# Altium schematic sheet IndAlarmIf1s.SchDoc
size A4
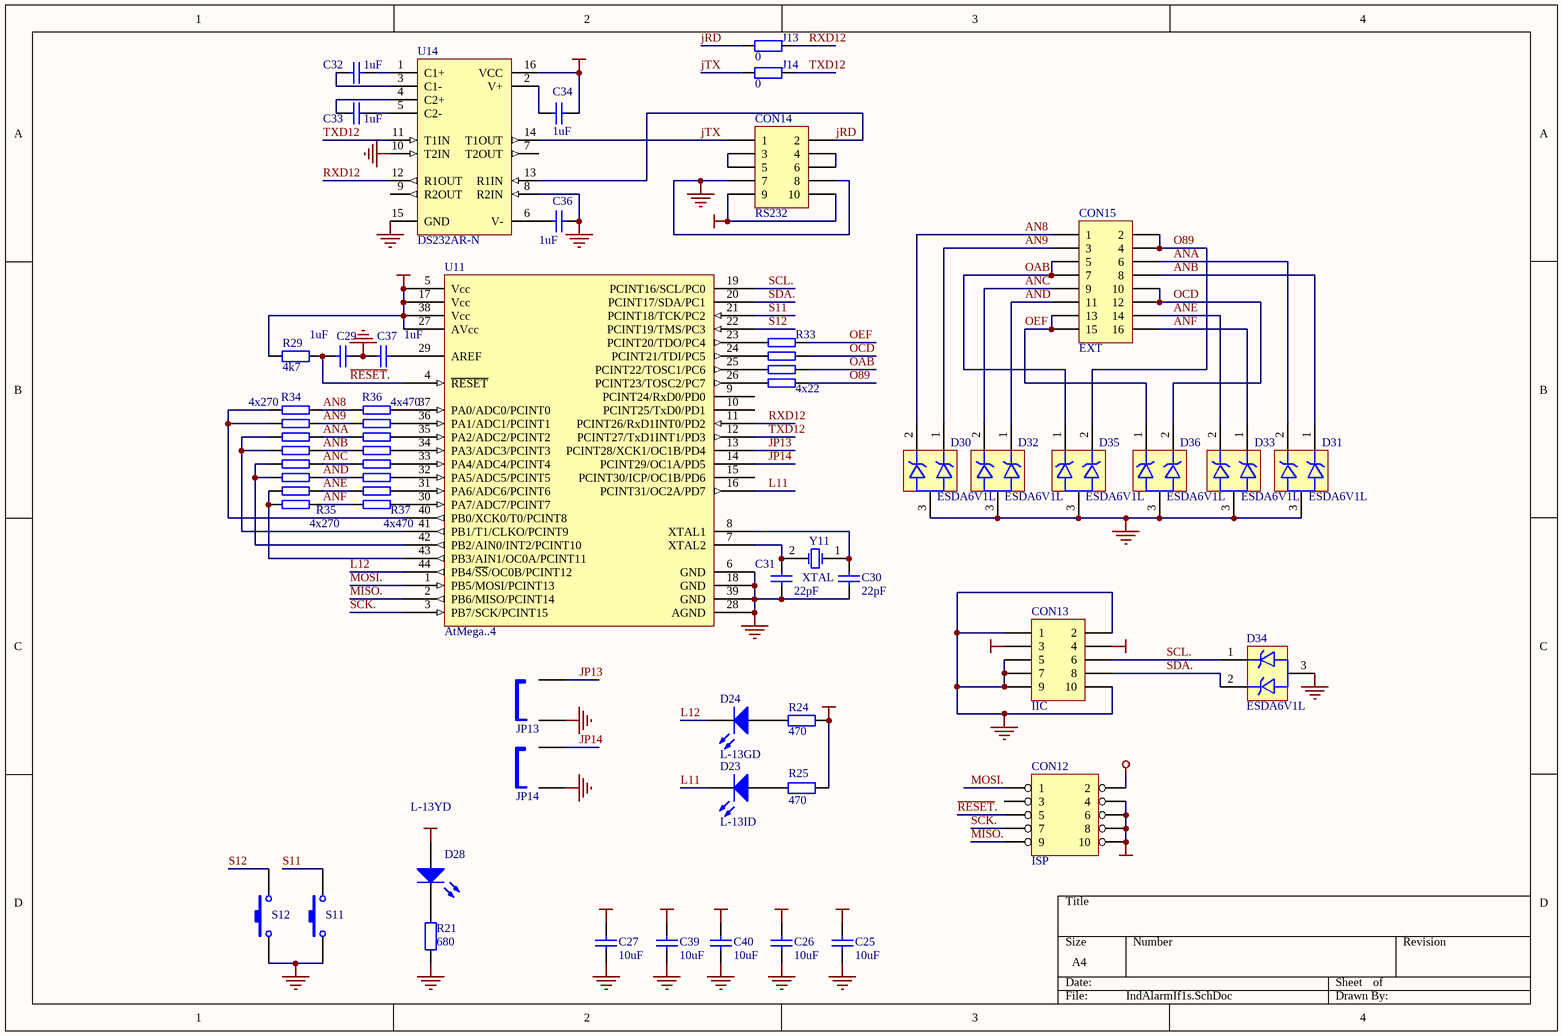
[diagram p0: IndAlarmIf1s.SchDoc]

## Parts
C25  value 10uF  [CC3216-1206]  (hidden comment: Cap Semi)
C26  value 10uF  [CC3216-1206]  (hidden comment: Cap Semi)
C27  value 10uF  [CC3216-1206]  (hidden comment: Cap Semi)
C29  value 1uF  [CC2012-0805]  (hidden comment: Cap Semi)
C30  value 22pF  [CC2012-0805]  (hidden comment: Cap Semi)
C31  value 22pF  [CC2012-0805]  (hidden comment: Cap Semi)
C32  value 1uF  [CC2012-0805]  (hidden comment: Cap Semi)
C33  value 1uF  [CC2012-0805]  (hidden comment: Cap Semi)
C34  value 1uF  [CC2012-0805]  (hidden comment: Cap Semi)
C36  value 1uF  [CC2012-0805]  (hidden comment: Cap Semi)
C37  value 1uF  [CC2012-0805]  (hidden comment: Cap Semi)
C39  value 10uF  [CC3216-1206]  (hidden comment: Cap Semi)
C40  value 10uF  [CC3216-1206]  (hidden comment: Cap Semi)
CON12  ISP  [HDR2X5]
CON13  IIC  [HDR2X5]
CON14  RS232  [HDR2X5]
CON15  EXT  [HDR2X8]
D23  L-13ID  [LED3mm]
D24  L-13GD  [LED3mm]
D28  L-13YD  [LED3mm]
D30  ESDA6V1L  [SO-G3/C2.5]
D31  ESDA6V1L  [SO-G3/C2.5]
D32  ESDA6V1L  [SO-G3/C2.5]
D33  ESDA6V1L  [SO-G3/C2.5]
D34  ESDA6V1L  [SO-G3/C2.5]
D35  ESDA6V1L  [SO-G3/C2.5]
D36  ESDA6V1L  [SO-G3/C2.5]
J13  value 0  [CR2012-0805]  (hidden comment: Res Semi)
J14  value 0  [CR2012-0805]  (hidden comment: Res Semi)
JP13  Jumper  [JP]  (value not drawn)
JP14  Jumper  [JP]  (value not drawn)
R21  value 680  [CR2012-0805]  (hidden comment: Res Semi)
R24  value 470  [CR2012-0805]  (hidden comment: Res Semi)
R25  value 470  [CR2012-0805]  (hidden comment: Res Semi)
R29  value 4k7  [CR2012-0805]  (hidden comment: Res Semi)
R33  4x22  [YC164]
R34  4x270  [YC164]
R35  4x270  [YC164]
R36  4x470  [YC164]
R37  4x470  [YC164]
S11  SW-PB  [SPPB512300+minicw]  (value not drawn)
S12  SW-PB  [SPPB6A0400-R]  (value not drawn)
U11  AtMega..4
U14  DS232AR-N  [SOIC16N]
Y11  XTAL  [HC49]

## Nets
GND: C25.1 C26.1 C27.1 C29.1 C30.2 C31.2 C36.1 C37.2 C39.1 C40.1 CON12.4 CON12.6 CON12.8 CON12.10 CON13.1 CON13.2 CON13.5 CON13.7 CON13.9 CON13.10 CON14.7 CON14.8 D30.3 D31.3 D32.3 D33.3 D34.3 D35.3 D36.3 JP13.1 JP14.1 R21.1 S11.2 S12.2 S12.3(GND) U11.6(GND) U11.18(GND) U11.28(AGND) U11.39(GND) U14.8(R2IN) U14.10(T2IN) U14.15(GND)
VCC: C25.2 C26.2 C27.2 C34.1 C39.2 C40.2 CON12.2 CON13.3 CON13.4 CON14.9 CON14.10 D28.1(A) R24.2 R25.2 R29.1 U11.5(Vcc) U11.17(Vcc) U11.27(AVcc) U11.38(Vcc) U14.16(VCC)
AN8: CON15.1 D30.2 R34.1 R36.8
AN9: CON15.3 D30.1 R34.2 R36.7
ANA: CON15.6 D31.2 R34.3 R36.6
ANB: CON15.8 D31.1 R34.4 R36.5
ANC: CON15.9 D32.2 R35.1 R37.8
AND: CON15.11 D32.1 R35.2 R37.7
ANE: CON15.14 D33.2 R35.3 R37.6
ANF: CON15.16 D33.1 R35.4 R37.5
JP13: JP13.2 U11.13(PCINT28/XCK1/OC1B/PD4)
JP14: JP14.2 U11.14(PCINT29/OC1A/PD5)
jRD: CON14.2 J13.1 U14.13(R1IN)
jTX: CON14.1 J14.1 U14.14(T1OUT)
L11: D23.2(K) U11.16(PCINT31/OC2A/PD7)
L12: D24.2(K) U11.44(PB4/~{SS}/OC0B/PCINT12)
MISO.: CON12.9 U11.2(PB6/MISO/PCINT14)
MOSI.: CON12.1 U11.1(PB5/MOSI/PCINT13)
O89: CON15.2 CON15.4 D35.2 R33.4
OAB: CON15.5 CON15.7 D35.1 R33.3
OCD: CON15.10 CON15.12 D36.2 R33.2
OEF: CON15.13 CON15.15 D36.1 R33.1
~{RESET}.: C29.2 CON12.5 R29.2 U11.4(~{RESET})
RXD12: J13.2 U11.11(PCINT26/RxD1INT0/PD2) U14.12(R1OUT)
S11: S11.1 U11.21(PCINT18/TCK/PC2)
S12: S12.1 U11.22(PCINT19/TMS/PC3)
SCK.: CON12.7 U11.3(PB7/SCK/PCINT15)
SCL.: CON13.6 D34.1 U11.19(PCINT16/SCL/PC0)
SDA.: CON13.8 D34.2 U11.20(PCINT17/SDA/PC1)
TXD12: J14.2 U11.12(PCINT27/TxD1INT1/PD3) U14.11(T1IN)
NetC30_1: C30.1 U11.8(XTAL1) Y11.1(OSC1)
NetC31_1: C31.1 U11.7(XTAL2) Y11.2(OSC2)
NetC32_1: C32.1 U14.1(C1+)
NetC32_2: C32.2 U14.3(C1-)
NetC33_1: C33.1 U14.5(C2-)
NetC33_2: C33.2 U14.4(C2+)
NetC34_2: C34.2 U14.2(V+)
NetC36_2: C36.2 U14.6(V-)
NetC37_1: C37.1 U11.29(AREF)
NetCON14_3: CON14.3 CON14.5
NetCON14_4: CON14.4 CON14.6
NetD23_1: D23.1(A) R25.1
NetD24_1: D24.1(A) R24.1
NetD28_2: D28.2(K) R21.2
NetR33_5: R33.5 U11.26(PCINT23/TOSC2/PC7)
NetR33_6: R33.6 U11.25(PCINT22/TOSC1/PC6)
NetR33_7: R33.7 U11.24(PCINT21/TDI/PC5)
NetR33_8: R33.8 U11.23(PCINT20/TDO/PC4)
NetR34_5: R34.5 R34.6 U11.41(PB1/T1/CLKO/PCINT9)
NetR34_7: R34.7 R34.8 U11.40(PB0/XCK0/T0/PCINT8)
NetR35_5: R35.5 R35.6 U11.43(PB3/AIN1/OC0A/PCINT11)
NetR35_7: R35.7 R35.8 U11.42(PB2/AIN0/INT2/PCINT10)
NetR36_1: R36.1 U11.37(PA0/ADC0/PCINT0)
NetR36_2: R36.2 U11.36(PA1/ADC1/PCINT1)
NetR36_3: R36.3 U11.35(PA2/ADC2/PCINT2)
NetR36_4: R36.4 U11.34(PA3/ADC3/PCINT3)
NetR37_1: R37.1 U11.33(PA4/ADC4/PCINT4)
NetR37_2: R37.2 U11.32(PA5/ADC5/PCINT5)
NetR37_3: R37.3 U11.31(PA6/ADC6/PCINT6)
NetR37_4: R37.4 U11.30(PA7/ADC7/PCINT7)

Not connected (* = marked no-connect by the designer): CON12 3; U11 9(PCINT24/RxD0/PD0) 10(PCINT25/TxD0/PD1) 15(PCINT30/ICP/OC1B/PD6); U14 7(T2OUT) 9(R2OUT)

## Library data of the parts
C25-C27 C29-C34 C36 C37 C39 C40 = Cap Semi: Capacitor (Semiconductor SIM Model); Published: 8-Jun-2000; Revision: July-2002: Re-released for DXP Platform.; Publisher: Altium Limited
CON12 = HEADER 5X2
CON13 CON14 = Header 5X2: Header, 5-Pin, Dual row; Revision: 17-Jul-2002: Re-released for DXP Platform.; Publisher: Altium Limited
CON15 = Header 8X2: Header, 8-Pin, Dual row; Revision: 17-Jul-2002: Re-released for DXP Platform.; Publisher: Altium Limited
D23 D24 D28 = LED3: Typical BLUE SiC LED; Revision 1: Jul-2002: Re-released for DXP Platform.; Revision 2: 17-Dec-2003: PCB Footprint replaced.; Published: 8-Jun-2000; Publisher: Altium Limited
D30-D36 = ESDA6V1L: DUAL TRANSIL ARRAY / FOR ESD PROTECTION
J13 J14 R21 R24 R25 R29 = Res Semi: Semiconductor Resistor; Published: 8-Jun-2000; Revision: July-2002: Re-released for DXP Platform.; Publisher: Altium Limited
JP13 JP14 = Jumper: Jumper Wire; Published: 24-Mar-1999; Revision: July-2002: Re-released for DXP Platform.; Publisher: Altium Limited
R33-R37 = RES4
S11 S12 = SW-PB: Switch; Published: 24-Mar-1999; Revision: July-2002: Re-released for DXP Platform.; Publisher: Altium Limited
U11 = ATMEGA164PA-AU
U14 = DS232AR-N: Dual RS-232 Transmitter/Receiver; Package Information: Latest Revision: 1999; Published: 13-Oct-2000; Revision: 17-Jul-2002: Re-released for DXP Platform.; Datasheet: Latest Revision: 19-Feb-1998; Package Reference: SOIC16N; Publisher: Altium Limited
Y11 = XTAL: Crystal Oscillator; Published: 8-Jun-2000; Revision: July-2002: Re-released for DXP Platform.; Publisher: Altium Limited